# Altium schematic sheet Power Supply.SchDoc
size 157 x 55 mm
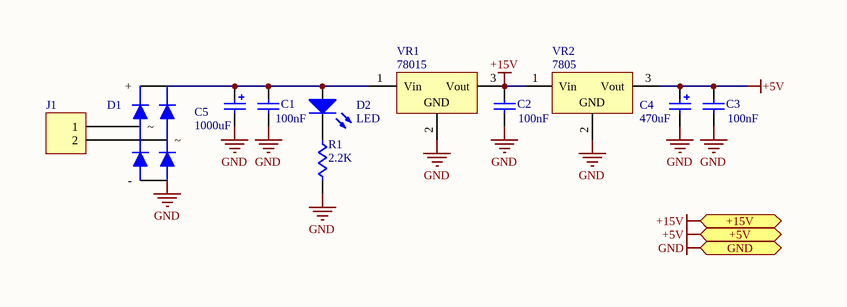
[diagram p0: Power Supply.SchDoc]

## Parts
C1  value 100nF  [CAPNTO2.54-3.05x1.78A]  (hidden comment: Cap)
C2  value 100nF  [CAPNTO2.54-3.05x1.78A]  (hidden comment: Cap)
C3  value 100nF  [CAPNTO2.54-3.05x1.78A]  (hidden comment: Cap)
C4  value 470uF  [CAPPR3.05-3.81x6.35]  (hidden comment: Cap Pol1)
C5  value 1000uF  [CAPPR5-10x12.5]  (hidden comment: Cap Pol1)
D1  Bridge_1  [KBP]  (value not drawn)
D2  LED  [LED-5mm_Red]
J1  Header 2  [Fonics_2PIN_1]  (value not drawn)
R1  value 2.2K  [AXIAL-0.4]  (hidden comment: Res1)
VR1  value 78015  [TO220V]  (hidden comment: Volt Reg)
VR2  value 7805  [TO220V]  (hidden comment: Volt Reg)

## Ports
+5V (out), +15V (out), GND (out)

## Nets
+5V: C3.2 C4.1 VR2.3(Vout) ; port +5V
+15V: C2.2 VR1.3(Vout) VR2.1(Vin) ; port +15V
GND: C1.1 C2.1 C3.1 C4.2 C5.2 D1.1(-) R1.2 VR1.2(GND) VR2.2(GND) ; port GND
NetC1_2: C1.2 C5.1 D1.3(+) D2.1(A) VR1.1(Vin)
NetD1_2: D1.2 J1.2
NetD1_4: D1.4 J1.1
NetD2_2: D2.2(K) R1.1

## Library data of the parts
C1-C3 = Cap: Capacitor; Manufacturer: Generic Components; Class I: Passive; Published: 8-Jun-2000; Revision: July-2002: Re-released for DXP Platform.; Publisher: Altium Limited; Class II: Capacitor
C4 C5 = Cap Pol1: Polarized Capacitor (Radial); Manufacturer: Generic Components; Class I: Passive; Published: 8-Jun-2000; Revision: July-2002: Re-released for DXP Platform.; Publisher: Altium Limited; Class II: Capacitor
D1 = Bridge_1: Full Wave Diode Bridge; Manufacturer: Generic Components; Class I: Discrete; Class II: Rectifier - Bridge; Published: 8-Jun-2000; Revision: July-2002: Re-released for DXP Platform.; Publisher: Altium Limited
D2 = LED: Typical INFRARED GaAs LED; Manufacturer: Generic Components; Class I: Optoelectronic; Published: 8-Jun-2000; Revision: July-2002: Re-released for DXP Platform.; Publisher: Altium Limited; Class II: LED
J1 = Header 2: Header, 2-Pin; LatestRevisionDate: 17-Jul-2002; LatestRevisionNote: Re-released for DXP Platform.; Publisher: Altium Limited
R1 = Res1: Resistor; Manufacturer: Generic Components; Class I: Passive; Published: 8-Jun-2000; Revision: July-2002: Re-released for DXP Platform.; Publisher: Altium Limited; Class II: Resistor
VR1 VR2 = Volt Reg: Voltage Regulator; Manufacturer: Generic Components; Class I: Power Management; Published: 24-Mar-1999; Revision: July-2002: Re-released for DXP Platform.; Publisher: Altium Limited; Class II: Voltage Regulator